# Altium schematic sheet Proyecto.SchDoc
size A4
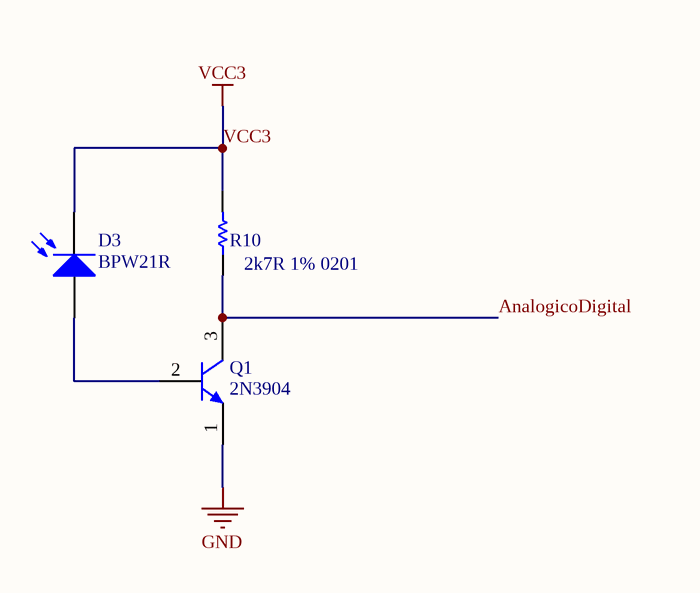
[diagram p0: Proyecto.SchDoc]

## Parts
D3  BPW21R  [VISH-BPW21R-2]
Q1  2N3904  [ONSC-TO-92-3-29-11]
R10  2k7R 1% 0201  [RESC0201(0603)_M]

## Nets
GND: Q1.1(E)
VCC3: D3.2(K) R10.2
AnalogicoDigital: Q1.3(C) R10.1
NetD3_1: D3.1(A) Q1.2(B)

## Library data of the parts
D3 = CMP-2000-05428-1: Silicon Photodiode, 565 nm, -40 to 125 degC, 2-Pin TO-5, RoHS, Bulk; Manufacturer: Vishay; Wavelength of Peak Sensitivity: 565nm; Dark Current: 2000pA; SVHC: ToBeAdvised; Angle of Half Sensitivity ±: 50deg; No. of Pins: 2Pins; Product Range: -; Manufacturer URL: http://www.vishay.com/; Operating Temperature Max: 125degC; Datasheet URL: https://datasheet.ciiva.com/25620/0900766b80e22c15-25620368.pdf; Diode Case Style: TO-5; Operating Temperature Min: -40degC; Automotive Qualification Standard: -; MSL: -; Packaging: Each; Datasheet Version: Rev. 1.7, 11/2011
Q1 = CMP-2000-05562-1: General Purpose Transistor, NPN Silicon, 200 mA, 60 V, -55 to 150 degC, 3-Pin TO-92, RoHS, Bulk; Manufacturer: ONSemiconductor; Emitter- Base Voltage VEBO: 6V; Maximum Power Dissipation: 625mW; Maximum DC Collector Current: 0.2A; Collector- Emitter Voltage VCEO Max: 40V; Collector- Base Voltage VCBO: 60V; DC Collector/Base Gain hfe Min: 60; Configuration: Single; Collector-Emitter Saturation Voltage: 0.3V; Gain Bandwidth Product fT: 270MHz; Mounting Style: ThroughHole; Package / Case: TO-92-3(TO-226); Mounting Technology: ThroughHole; Minimum Operating Temperature: -65C; Datasheet Version: Rev. 8, 08/2012; Product Category: BipolarTransistors-BJT; Factory Pack Quantity: 5000; Transistor Polarity: NPN; Package Description: 3-Pin Transistor Outline, Body 4.825 x 3.685 mm, Pitch 1.27 mm; RoHS: Details; Datasheet URL: https://datasheet.ciiva.com/4725/2n3903-d-285841-4725808.pdf; Packaging: Bulk; Maximum Operating Temperature: +150C; Package Reference: TO-92-3-29-11; Brand: ONSemiconductor; Manufacturer URL: http://www.onsemi.com/
R10 = CMP-1010-00335-1: 200R 0.05W 1% 0201 (0603 Metric)  SMD; Case-Metric: 0603; Case-EIA: 0201; Value: 2700 Ohm; Power: 0.05 W; Technology: SMT; Tolerance: 1 %